# EAGLE schematic WSTL18P1 (EAGLE 7.7.0)
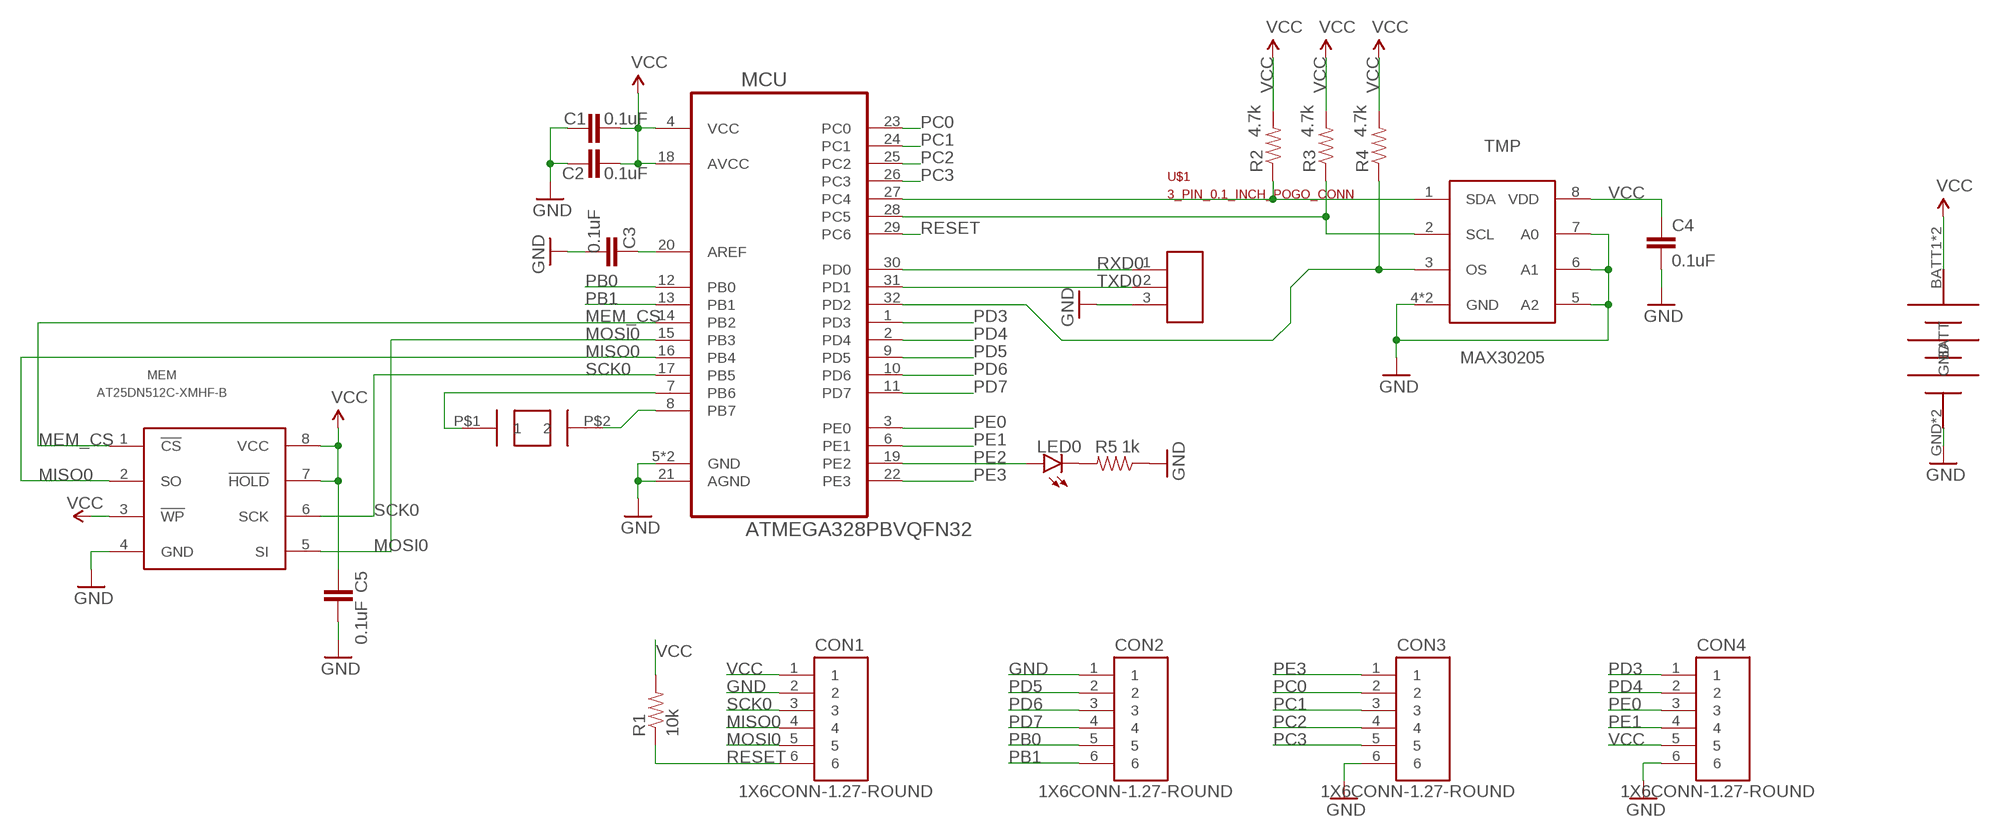
[diagram p0: schematic, sheet 1]

## Parts
BAT  LINX-CR2032-BAT-HLD-001-M  [CR2032-LINX-M]
C1  0.1uF  CAP_0402_CERAMIC  [CAP_0402]
C2  0.1uF  CAP_0402_CERAMIC  [CAP_0402]
C3  0.1uF  CAP_0402_CERAMIC  [CAP_0402]
C4  0.1uF  CAP_0402_CERAMIC  [CAP_0402]
C5  0.1uF  CAP_0402_CERAMIC  [CAP_0402]
CON1  1X6CONN-1.27-ROUND  [1X6_1.27_ROUND]
CON2  1X6CONN-1.27-ROUND  [1X6_1.27_ROUND]
CON3  1X6CONN-1.27-ROUND  [1X6_1.27_ROUND]
CON4  1X6CONN-1.27-ROUND  [1X6_1.27_ROUND]
LED0  LED_0402  [LED_0402]
MCU  ATMEGA328PBVQFN32  [ATMEGA328PB_VFQFN32]
MEM  AT25DN512C-XMHF-B  [TSSSOP-8]
R1  10k  RES_0402_CERAMIC  [RES_0402]
R2  4.7k  RES_0402_CERAMIC  [RES_0402]
R3  4.7k  RES_0402_CERAMIC  [RES_0402]
R4  4.7k  RES_0402_CERAMIC  [RES_0402]
R5  1k  RES_0402_CERAMIC  [RES_0402]
T1  ABS07AIG  [ABS07AIG]
TMP  MAX30205  [MAX30205_TDFN8]
U$1  3_PIN_0.1_INCH_POGO_CONN  [3_PIN_0.1INCH_POGO_PADS]

## Nets
GND [GND]: BAT.GND BAT.GND1(GND) C1.2 C2.2 C3.2 C4.2 C5.2 CON1.2 CON2.1 CON3.6 CON4.6 MCU.5(GND) MCU.21(AGND) MCU.PAD(GND) MEM.4(GND) R5.2 TMP.4(GND) TMP.5(A2) TMP.6(A1) TMP.7(A0) TMP.PAD(GND) U$1.3
MEM_CS [Signal]: MCU.14(PB2) MEM.1(!CS!)
MISO0 [Signal]: CON1.4 MCU.16(PB4) MEM.2(SO)
MOSI0 [Signal]: CON1.5 MCU.15(PB3) MEM.5(SI)
N$1 [Signal]: MCU.8(PB7) T1.P$2
N$2 [Signal]: MCU.7(PB6) T1.P$1
N$3: C3.1 MCU.20(AREF)
N$4: LED0.CATHODE(C) R5.1
PB0: CON2.5 MCU.12(PB0)
PB1: CON2.6 MCU.13(PB1)
PC0: CON3.2 MCU.23(PC0)
PC1: CON3.3 MCU.24(PC1)
PC2: CON3.4 MCU.25(PC2)
PC3: CON3.5 MCU.26(PC3)
PD3: CON4.1 MCU.1(PD3)
PD4: CON4.2 MCU.2(PD4)
PD5: CON2.2 MCU.9(PD5)
PD6: CON2.3 MCU.10(PD6)
PD7: CON2.4 MCU.11(PD7)
PE0: CON4.3 MCU.3(PE0)
PE1: CON4.4 MCU.6(PE1)
PE2: LED0.ANODE(A) MCU.19(PE2)
PE3: CON3.1 MCU.22(PE3)
RESET [Signal]: CON1.6 MCU.29(PC6) R1.2
RXD0 [Signal]: MCU.30(PD0) U$1.1
SCK0 [Signal]: CON1.3 MCU.17(PB5) MEM.6(SCK)
SCL0 [Signal]: MCU.28(PC5) R3.2 TMP.2(SCL)
SDA0 [Signal]: MCU.27(PC4) R2.2 TMP.1(SDA)
TMP_INT: MCU.32(PD2) R4.2 TMP.3(OS)
TXD0 [Signal]: MCU.31(PD1) U$1.2
VCC: BAT.BATT1(BATT) BAT.BATT2(BATT) C1.1 C2.1 C4.1 C5.1 CON1.1 CON4.5 MCU.4(VCC) MCU.18(AVCC) MEM.3(!WP!) MEM.7(!HOLD!) MEM.8(VCC) R1.1 R2.1 R3.1 R4.1 TMP.8(VDD)

## Library data of the parts
BAT = Battery_holders:LINX-CR2032-BAT-HLD-001-M
C1-C5 = Passives:CAP_0402_CERAMIC
CON1-CON4 = AVR_ISP_127:1X6CONN-1.27-ROUND
LED0 = Passives:LED_0402
MCU = ATMEGA328PB:ATMEGA328PB: Atmel's new 8-bit Microcontroller with In-System Programmable Flash and other goodies to replace venerable 328P
MEM = Memory:AT25DN512C-XMHF-B
R1-R5 = Passives:RES_0402_CERAMIC
T1 = ABS07AIG:ABS07AIG: Abracon ABS07AIG crystal
TMP = MAX30205:MAX30205: MAX30205 Temperature sensor by Maxim
U$1 = Connectors:3_PIN_0.1_INCH_POGO_CONN

## Net classes
1 GND: width 0.254 mm, drill 0.305 mm, clearance 0.356 mm
2 Signal: width 0.203 mm, drill 0.305 mm, clearance 0.203 mm